# Altium project RcMPPT-BMS.PrjPcb
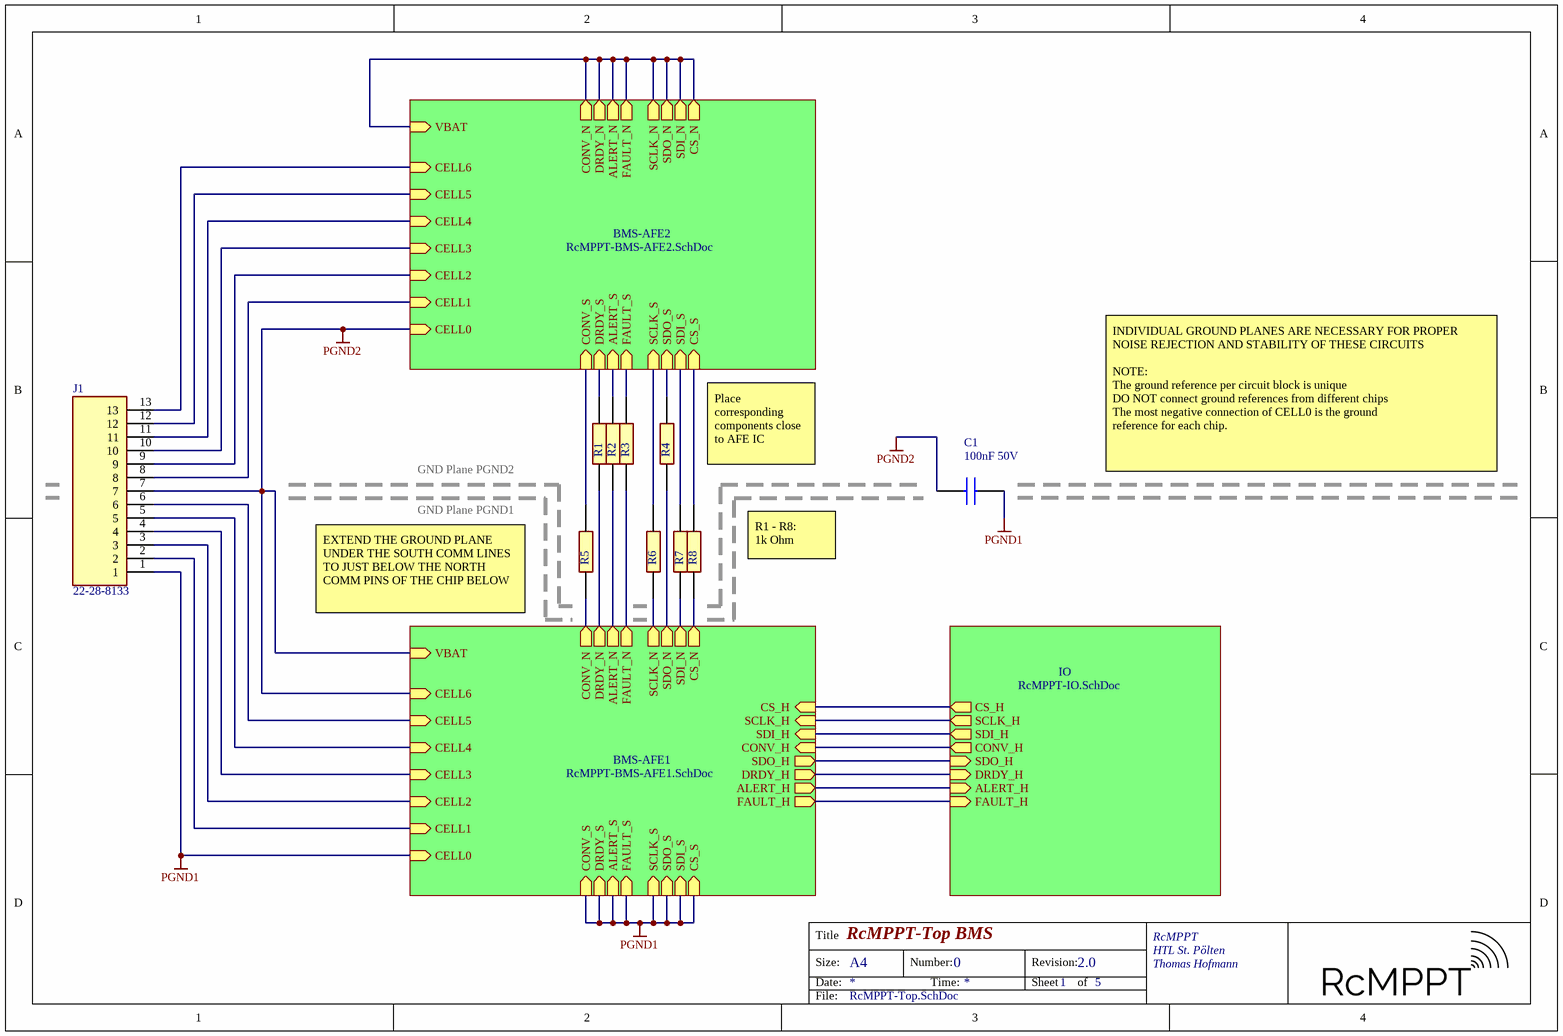
[diagram p0: RcMPPT-Top.SchDoc]
5 sheets, 194 parts. Net scope: hierarchical (ports join the sheet entries above them; power ports are global).
Board file: RcMPPT-BMS.PcbDoc
Sheets:
  RcMPPT-Top.SchDoc
    IO = RcMPPT-IO.SchDoc
    BMS-AFE1 = RcMPPT-BMS-AFE1.SchDoc
      U_RcMPPT-BMS-BFE-1-1 = RcMPPT-BMS-BFE.SchDoc
      U_RcMPPT-BMS-BFE-1-2 = RcMPPT-BMS-BFE.SchDoc
      U_RcMPPT-BMS-BFE-1-3 = RcMPPT-BMS-BFE.SchDoc
      U_RcMPPT-BMS-BFE-1-4 = RcMPPT-BMS-BFE.SchDoc
      U_RcMPPT-BMS-BFE-1-5 = RcMPPT-BMS-BFE.SchDoc
      U_RcMPPT-BMS-BFE-1-6 = RcMPPT-BMS-BFE.SchDoc
    BMS-AFE2 = RcMPPT-BMS-AFE2.SchDoc
      U_RcMPPT-BMS-BFE-2-1 = RcMPPT-BMS-BFE.SchDoc
      U_RcMPPT-BMS-BFE-2-2 = RcMPPT-BMS-BFE.SchDoc
      U_RcMPPT-BMS-BFE-2-3 = RcMPPT-BMS-BFE.SchDoc
      U_RcMPPT-BMS-BFE-2-4 = RcMPPT-BMS-BFE.SchDoc
      U_RcMPPT-BMS-BFE-2-5 = RcMPPT-BMS-BFE.SchDoc
      U_RcMPPT-BMS-BFE-2-6 = RcMPPT-BMS-BFE.SchDoc

## Sheet RcMPPT-Top.SchDoc: RcMPPT-Top BMS
size A4; Author: Thomas Hofmann; CompanyName: HTL St. Pölten; Address2: Frenchs Forest; Address3: NSW; Address4: Australia 2086; DocumentNumber: 0; Revision: 2.0; SheetNumber: 1; SheetTotal: 5

### Parts
C1  100nF 50V  [CAPC1608X97N]
J1  22-28-8133  [HDRRA13W66P0X254_1X13_3302X229X249P]
R1  1k  [RESC1005X40N]  (value not drawn)
R2  1k  [RESC1005X40N]  (value not drawn)
R3  1k  [RESC1005X40N]  (value not drawn)
R4  1k  [RESC1005X40N]  (value not drawn)
R5  1k  [RESC1005X40N]  (value not drawn)
R6  1k  [RESC1005X40N]  (value not drawn)
R7  1k  [RESC1005X40N]  (value not drawn)
R8  1k  [RESC1005X40N]  (value not drawn)

### Sub-sheets
BMS-AFE1 = RcMPPT-BMS-AFE1.SchDoc: CONV_N (out), DRDY_N (out), ALERT_N (out), FAULT_N (out), SCLK_N (out), SDO_N (out), SDI_N (out), CS_N (out), CONV_S (in), DRDY_S (in), ALERT_S (in), FAULT_S (in), SCLK_S (in), SDO_S (in), SDI_S (in), CS_S (in), VBAT (in), CELL0 (in), CELL1 (in), CELL2 (in), CELL3 (in), CELL4 (in), CELL5 (in), CELL6 (in), CS_H (in), SCLK_H (in), SDI_H (in), CONV_H (in), SDO_H (out), DRDY_H (out), ALERT_H (out), FAULT_H (out)
BMS-AFE2 = RcMPPT-BMS-AFE2.SchDoc: CONV_N (out), DRDY_N (out), ALERT_N (out), FAULT_N (out), SCLK_N (out), SDO_N (out), SDI_N (out), CS_N (out), CONV_S (in), DRDY_S (in), ALERT_S (in), FAULT_S (in), SCLK_S (in), SDO_S (in), SDI_S (in), CS_S (in), VBAT (in), CELL0 (in), CELL1 (in), CELL2 (in), CELL3 (in), CELL4 (in), CELL5 (in), CELL6 (in)
IO = RcMPPT-IO.SchDoc: CS_H (out), SCLK_H (out), SDI_H (out), CONV_H (out), SDO_H (in), DRDY_H (in), ALERT_H (in), FAULT_H (in)

### Nets
PGND1: C1.1 J1.1 ; sheet BMS-AFE1/CONV_S, sheet BMS-AFE1/DRDY_S, sheet BMS-AFE1/ALERT_S, sheet BMS-AFE1/FAULT_S, sheet BMS-AFE1/SCLK_S, sheet BMS-AFE1/SDO_S, sheet BMS-AFE1/SDI_S, sheet BMS-AFE1/CS_S, sheet BMS-AFE1/CELL0
PGND2: C1.2 J1.7 ; sheet BMS-AFE1/VBAT, sheet BMS-AFE1/CELL6, sheet BMS-AFE2/CELL0
NetC200_2: J1.13 ; sheet BMS-AFE2/CONV_N, sheet BMS-AFE2/DRDY_N, sheet BMS-AFE2/ALERT_N, sheet BMS-AFE2/FAULT_N, sheet BMS-AFE2/SCLK_N, sheet BMS-AFE2/SDO_N, sheet BMS-AFE2/SDI_N, sheet BMS-AFE2/CS_N, sheet BMS-AFE2/VBAT, sheet BMS-AFE2/CELL6
NetC300_U_RcMPPT-BMS-BFE-1-1_2: J1.2 ; sheet BMS-AFE1/CELL1
NetC300_U_RcMPPT-BMS-BFE-1-2_2: J1.3 ; sheet BMS-AFE1/CELL2
NetC300_U_RcMPPT-BMS-BFE-1-3_2: J1.4 ; sheet BMS-AFE1/CELL3
NetC300_U_RcMPPT-BMS-BFE-1-4_2: J1.5 ; sheet BMS-AFE1/CELL4
NetC300_U_RcMPPT-BMS-BFE-1-5_2: J1.6 ; sheet BMS-AFE1/CELL5
NetC300_U_RcMPPT-BMS-BFE-2-1_2: J1.8 ; sheet BMS-AFE2/CELL1
NetC300_U_RcMPPT-BMS-BFE-2-2_2: J1.9 ; sheet BMS-AFE2/CELL2
NetC300_U_RcMPPT-BMS-BFE-2-3_2: J1.10 ; sheet BMS-AFE2/CELL3
NetC300_U_RcMPPT-BMS-BFE-2-4_2: J1.11 ; sheet BMS-AFE2/CELL4
NetC300_U_RcMPPT-BMS-BFE-2-5_2: J1.12 ; sheet BMS-AFE2/CELL5
NetIC100_36: sheet IO/CONV_H, sheet BMS-AFE1/CONV_H
NetIC100_37: sheet IO/DRDY_H, sheet BMS-AFE1/DRDY_H
NetIC100_38: sheet IO/ALERT_H, sheet BMS-AFE1/ALERT_H
NetIC100_39: sheet IO/FAULT_H, sheet BMS-AFE1/FAULT_H
NetIC100_40: sheet IO/SCLK_H, sheet BMS-AFE1/SCLK_H
NetIC100_41: sheet IO/SDO_H, sheet BMS-AFE1/SDO_H
NetIC100_42: sheet IO/SDI_H, sheet BMS-AFE1/SDI_H
NetIC100_43: sheet IO/CS_H, sheet BMS-AFE1/CS_H
NetIC100_52: R8.1 ; sheet BMS-AFE1/CS_N
NetIC100_53: R7.1 ; sheet BMS-AFE1/SDI_N
NetIC100_54: R4.1 ; sheet BMS-AFE1/SDO_N
NetIC100_55: R6.1 ; sheet BMS-AFE1/SCLK_N
NetIC100_56: R3.1 ; sheet BMS-AFE1/FAULT_N
NetIC100_57: R2.1 ; sheet BMS-AFE1/ALERT_N
NetIC100_58: R1.1 ; sheet BMS-AFE1/DRDY_N
NetIC100_59: R5.1 ; sheet BMS-AFE1/CONV_N
NetIC200_21: R5.2 ; sheet BMS-AFE2/CONV_S
NetIC200_22: R1.2 ; sheet BMS-AFE2/DRDY_S
NetIC200_23: R2.2 ; sheet BMS-AFE2/ALERT_S
NetIC200_24: R3.2 ; sheet BMS-AFE2/FAULT_S
NetIC200_26: R6.2 ; sheet BMS-AFE2/SCLK_S
NetIC200_27: R4.2 ; sheet BMS-AFE2/SDO_S
NetIC200_28: R7.2 ; sheet BMS-AFE2/SDI_S
NetIC200_29: R8.2 ; sheet BMS-AFE2/CS_S

### Notes on the sheet
- GND Plane PGND2
- GND Plane PGND1
- (near R4) Place corresponding components close to AFE IC
- INDIVIDUAL GROUND PLANES ARE NECESSARY FOR PROPER
  NOISE REJECTION AND STABILITY OF THESE CIRCUITS
  NOTE:
  The ground reference per circuit block is unique
  DO NOT connect ground references from different chips
  The most negative connection of CELL0 is the ground
  reference for each chip.
- R1 - R8:
  1k Ohm
- EXTEND THE GROUND PLANE
  UNDER THE SOUTH COMM LINES
  TO JUST BELOW THE NORTH
  COMM PINS OF THE CHIP BELOW
- Title
- Size:
- Date:
- A4
- Number:
- Time:
- Revision:
- Sheet
- of
- RcMPPT
- File:

### Library data of the parts
C1 = C0603: Capacitor; Height: 0.97
J1 = 22-28-8133: Connector; Manufacturer_Name: Molex; Datasheet Link: https://www.molex.com/pdm_docs/sd/022288133_sd.pdf; Height: 2.49mm; Manufacturer_Part_Number: 22-28-8133; Mouser Part Number: 538-22-28-8133; Mouser Price/Stock: https://www.mouser.co.uk/ProductDetail/Molex/22-28-8133?qs=l%252BWx29wYPrwPQBTZUVDqKw%3D%3D
R1-R8 = R0402: Resistor; Height: 0.4mm

## Sheet RcMPPT-IO.SchDoc: RcMPPT-BMS-IO
size A4; Author: Thomas Hofmann; CompanyName: HTL St. Pölten; Organization: HTL St. Pölten; Address1: RcMPPT; Address2: Frenchs Forest; Address3: NSW; Address4: Australia 2086; DocumentNumber: 5; Revision: 2.0; SheetNumber: 5; SheetTotal: 5
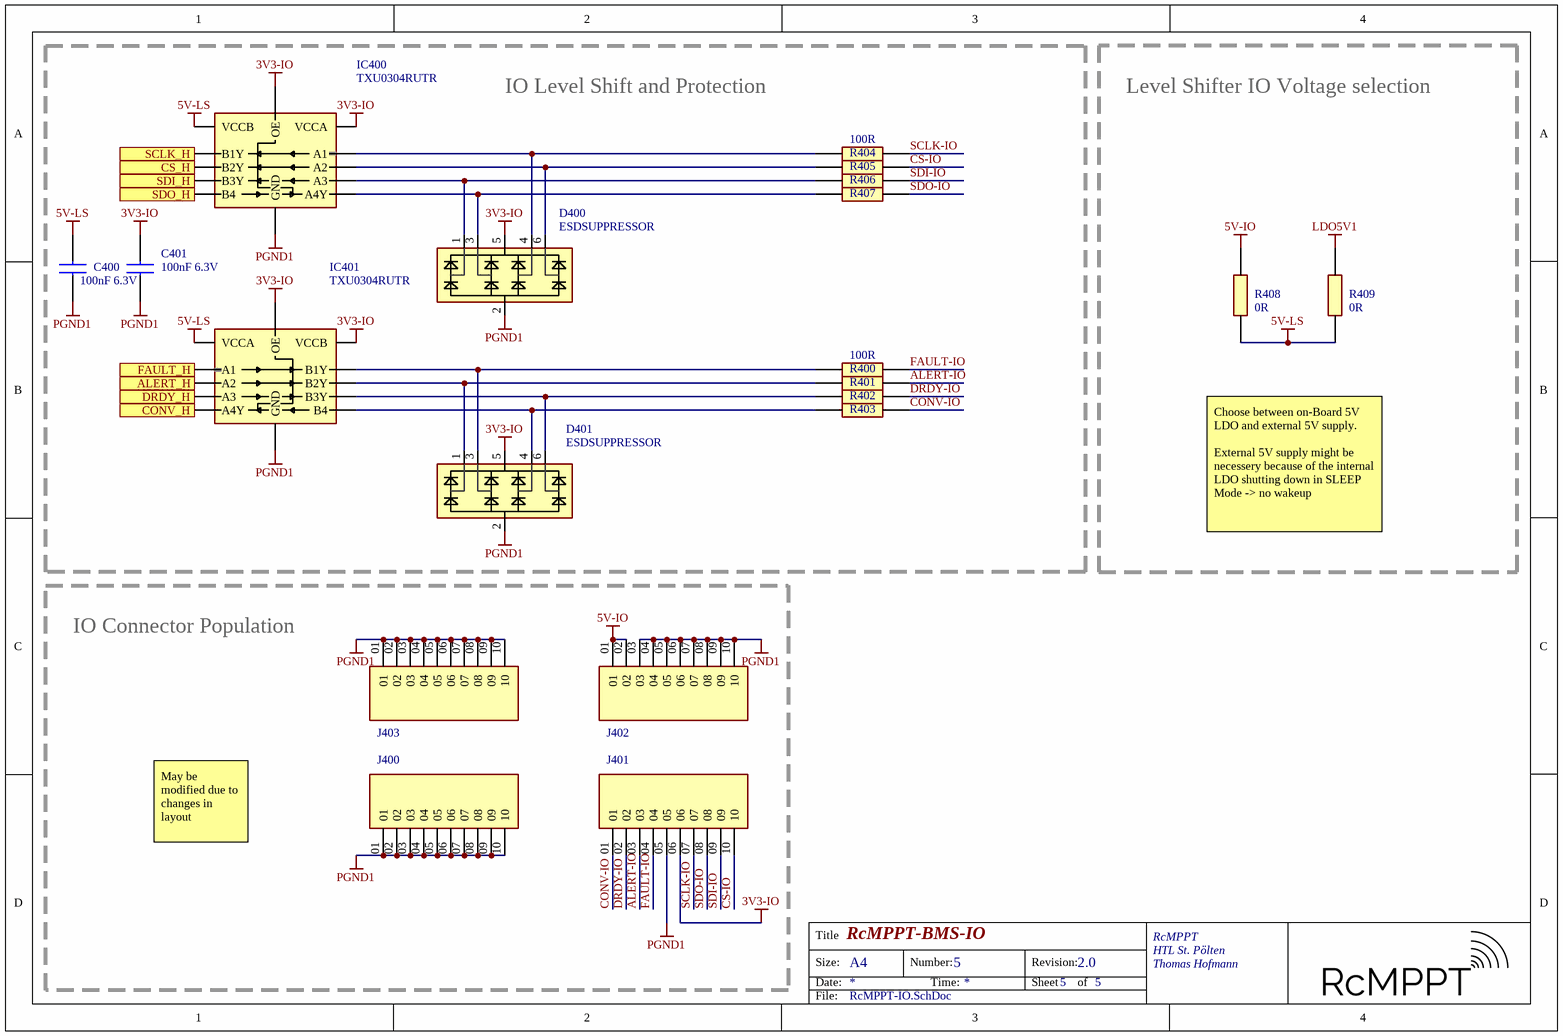
[diagram p1: RcMPPT-IO.SchDoc]

### Parts
C400  100nF 6.3V  [CAPC1608X97N]
C401  100nF 6.3V  [CAPC1608X97N]
D400  ESDSUPPRESSOR  [SOT23-6]
D401  ESDSUPPRESSOR  [SOT23-6]
IC400  TXU0304RUTR  [UQFN-12]
IC401  TXU0304RUTR  [UQFN-12]
J400  SMS-110-01-G-S  [SAMTEC_SMS-110-X-X-S]  (value not drawn)
J401  SMS-110-01-G-S  [SAMTEC_SMS-110-X-X-S]  (value not drawn)
J402  SMS-110-01-G-S  [SAMTEC_SMS-110-X-X-S]  (value not drawn)
J403  SMS-110-01-G-S  [SAMTEC_SMS-110-X-X-S]  (value not drawn)
R400  100R  [RESC1005X40N]
R401  100R  [RESC1005X40N]  (value not drawn)
R402  100R  [RESC1005X40N]  (value not drawn)
R403  100R  [RESC1005X40N]  (value not drawn)
R404  100R  [RESC1005X40N]
R405  100R  [RESC1005X40N]  (value not drawn)
R406  100R  [RESC1005X40N]  (value not drawn)
R407  100R  [RESC1005X40N]  (value not drawn)
R408  0R  [RESC1005X40N]
R409  0R  [RESC1005X40N]

### Blocks framed on the sheet
IO Level Shift and Protection: C400 C401 D400 D401 IC400 IC401 R400-R407
Level Shifter IO Voltage selection: R408 R409
IO Connector Population: J400-J403

### Ports
ALERT_H (in), CONV_H (out), CS_H (out), DRDY_H (in), FAULT_H (in), SCLK_H (out), SDI_H (out), SDO_H (in)

### Nets
3V3-IO: C401.2 D400.5(VDD) D401.5(VDD) IC400.1,_13(VCCA) IC400.12(OE) IC401.11(VCCB) IC401.12(OE) J401.06
5V-IO: J402.01 J402.02 R408.2
5V-LS: C400.2 IC400.11(VCCB) IC401.1,_13(VCCA) R408.1 R409.1
LDO5V1: R409.2
PGND1: C400.1 C401.1 D400.2(GND) D401.2(GND) IC400.6(GND) IC401.6(GND) J400.01 J400.02 J400.03 J400.04 J400.05 J400.06 J400.07 J400.08 J400.09 J400.10 J401.05 J402.03 J402.04 J402.05 J402.06 J402.07 J402.08 J402.09 J402.10 J403.01 J403.02 J403.03 J403.04 J403.05 J403.06 J403.07 J403.08 J403.09 J403.10
ALERT-IO: J401.03 R401.2  [project net ALERT-IO_5]
CONV-IO: J401.01 R403.2  [project net CONV-IO_5]
CS-IO: J401.10 R405.2  [project net CS-IO_5]
DRDY-IO: J401.02 R402.2  [project net DRDY-IO_5]
FAULT-IO: J401.04 R400.2  [project net FAULT-IO_5]
SCLK-IO: J401.07 R404.2  [project net SCLK-IO_5]
SDI-IO: J401.09 R406.2  [project net SDI-IO_5]
SDO-IO: J401.08 R407.2  [project net SDO-IO_5]
NetD400_1: D400.1(CH1) IC400.4(A3) R406.1
NetD400_3: D400.3(CH2) IC400.5(A4Y) R407.1
NetD400_4: D400.4(CH3) IC400.2(A1) R404.1
NetD400_6: D400.6(CH4) IC400.3(A2) R405.1
NetD401_1: D401.1(CH1) IC401.9(B2Y) R401.1
NetD401_3: D401.3(CH2) IC401.10(B1Y) R400.1
NetD401_4: D401.4(CH3) IC401.7(B4) R403.1
NetD401_6: D401.6(CH4) IC401.8(B3Y) R402.1
NetIC100_36: IC401.5(A4Y) ; port CONV_H
NetIC100_37: IC401.4(A3) ; port DRDY_H
NetIC100_38: IC401.3(A2) ; port ALERT_H
NetIC100_39: IC401.2(A1) ; port FAULT_H
NetIC100_40: IC400.10(B1Y) ; port SCLK_H
NetIC100_41: IC400.7(B4) ; port SDO_H
NetIC100_42: IC400.8(B3Y) ; port SDI_H
NetIC100_43: IC400.9(B2Y) ; port CS_H

### Notes on the sheet
- Choose between on-Board 5V LDO and external 5V supply.
  External 5V supply might be necessery because of the internal LDO shutting down in SLEEP Mode -> no wakeup
- May be modified due to changes in layout
- Title
- Size:
- Date:
- A4
- Number:
- Time:
- Revision:
- Sheet
- of
- RcMPPT
- File:

### Library data of the parts
C400 C401 = C0603: Capacitor; Height: 0.97
D400 D401 = ESDSUPPRESSOR: TVS Diode Array; Height: 0.6mm
IC400 IC401 = TXU0304RUTR: Integrated Circuit; Manufacturer_Name: Texas Instruments; Datasheet Link: https://www.ti.com/lit/ds/symlink/txu0304.pdf?ts=1639746896730&ref_url=https%253A%252F%252Fwww.ti.com%252Fproduct%252FTXU0304; Manufacturer_Part_Number: TXU0304RUTR; Mouser Part Number: 595-TXU0304RUTR; Mouser Price/Stock: https://www.mouser.at/ProductDetail/Texas-Instruments/TXU0304RUTR?qs=pBJMDPsKWf1XxvxZVB4EQA%3D%3D
J400-J403 = SMS-110-X-X-S: 10 Position Receptacle Connector 0.050" (1.27mm) Through Hole Gold; MF: {'manufacturer': u'Samtec'}; Package: None; Availability: Unavailable; Value: *; MP: SMS-110-X-X-S; Price: None
R400-R409 = R0402: Resistor; Height: 0.4mm

## Sheet RcMPPT-BMS-AFE1.SchDoc: RcMPPT-BMS-AFE-1
size A4; Author: Thomas Hofmann; CompanyName: HTL St. Pölten; Organization: Altium Limited; Address1: RcMPPT; Address2: Frenchs Forest; Address3: NSW; Address4: Australia 2086; DocumentNumber: 2; Revision: 2.0; SheetNumber: 2; SheetTotal: 5
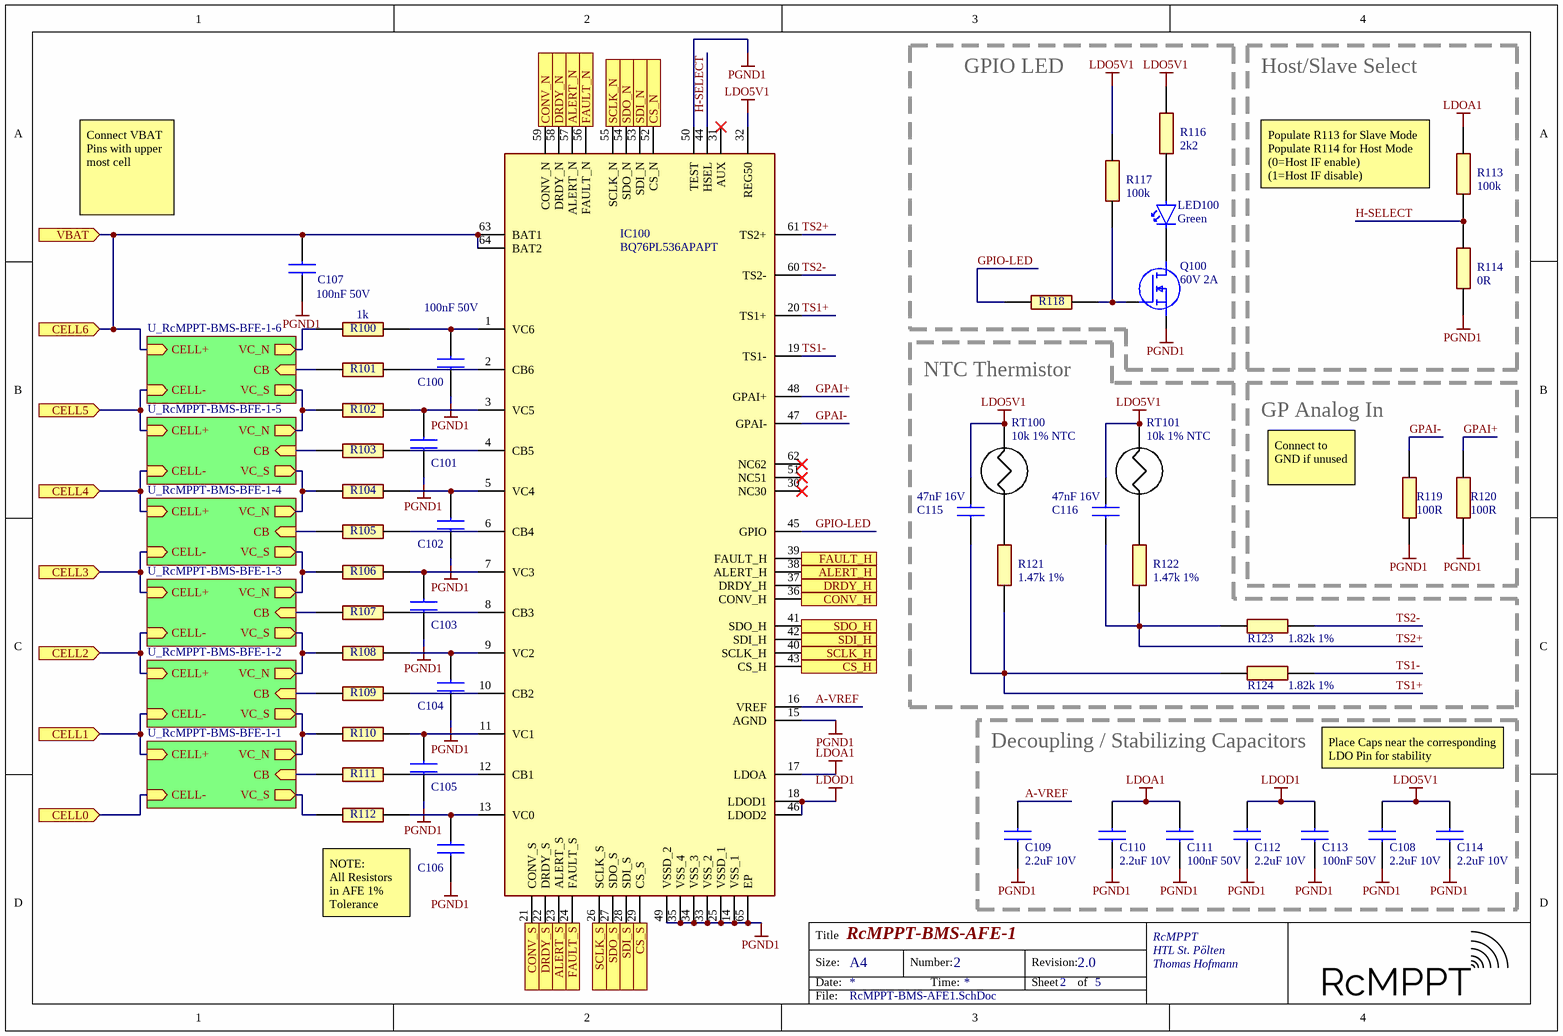
[diagram p2: RcMPPT-BMS-AFE1.SchDoc]

### Parts
C100  100nF 50V  [CAPC1608X97N]
C101  100nF 50V  [CAPC1608X97N]  (value not drawn)
C102  100nF 50V  [CAPC1608X97N]  (value not drawn)
C103  100nF 50V  [CAPC1608X97N]  (value not drawn)
C104  100nF 50V  [CAPC1608X97N]  (value not drawn)
C105  100nF 50V  [CAPC1608X97N]  (value not drawn)
C106  100nF 50V  [CAPC1608X97N]  (value not drawn)
C107  100nF 50V  [CAPC1608X97N]
C108  2.2uF 10V  [CAPC1608X97N]
C109  2.2uF 10V  [CAPC1608X97N]
C110  2.2uF 10V  [CAPC1608X97N]
C111  100nF 50V  [CAPC1608X97N]
C112  2.2uF 10V  [CAPC1608X97N]
C113  100nF 50V  [CAPC1608X97N]
C114  2.2uF 10V  [CAPC1608X97N]
C115  47nF 16V  [CAPC1608X97N]
C116  47nF 16V  [CAPC1608X97N]
IC100  BQ76PL536APAPT  [QFP50P1200X1200X120-65N]
LED100  Green  [CHIPLED_0603]
Q100  60V 2A  [SOT96P240X110-3N]
R100  1k  [RESC1005X40N]
R101  1k  [RESC1005X40N]  (value not drawn)
R102  1k  [RESC1005X40N]  (value not drawn)
R103  1k  [RESC1005X40N]  (value not drawn)
R104  1k  [RESC1005X40N]  (value not drawn)
R105  1k  [RESC1005X40N]  (value not drawn)
R106  1k  [RESC1005X40N]  (value not drawn)
R107  1k  [RESC1005X40N]  (value not drawn)
R108  1k  [RESC1005X40N]  (value not drawn)
R109  1k  [RESC1005X40N]  (value not drawn)
R110  1k  [RESC1005X40N]  (value not drawn)
R111  1k  [RESC1005X40N]  (value not drawn)
R112  1k  [RESC1005X40N]  (value not drawn)
R113  100k  [RESC1005X40N]
R114  0R  [RESC1005X40N]
R116  2k2  [RESC1005X40N]
R117  100k  [RESC1005X40N]
R118  100R  [RESC1005X40N]  (value not drawn)
R119  100R  [RESC1005X40N]
R120  100R  [RESC1005X40N]
R121  1.47k 1%  [RESC1608X50N]
R122  1.47k 1%  [RESC1608X50N]
R123  1.82k 1%  [RESC1608X50N]
R124  1.82k 1%  [RESC1608X50N]
RT100  10k 1% NTC  [THRMC1608X90N]
RT101  10k 1% NTC  [THRMC1608X90N]

### Blocks framed on the sheet
GPIO LED: LED100 Q100 R116-R118
Host/Slave Select: R113 R114
NTC Thermistor: C115 C116 R121-R124 RT100 RT101
GP Analog In: R119 R120
Decoupling / Stabilizing Capacitors: C108-C114

### Sub-sheets
U_RcMPPT-BMS-BFE-1-1 = RcMPPT-BMS-BFE.SchDoc: CB (in), VC_S (out), CELL+ (in), CELL- (in), VC_N (out)
U_RcMPPT-BMS-BFE-1-2 = RcMPPT-BMS-BFE.SchDoc: CB (in), VC_S (out), CELL+ (in), CELL- (in), VC_N (out)
U_RcMPPT-BMS-BFE-1-3 = RcMPPT-BMS-BFE.SchDoc: CB (in), VC_S (out), CELL+ (in), CELL- (in), VC_N (out)
U_RcMPPT-BMS-BFE-1-4 = RcMPPT-BMS-BFE.SchDoc: CB (in), VC_S (out), CELL+ (in), CELL- (in), VC_N (out)
U_RcMPPT-BMS-BFE-1-5 = RcMPPT-BMS-BFE.SchDoc: CB (in), VC_S (out), CELL+ (in), CELL- (in), VC_N (out)
U_RcMPPT-BMS-BFE-1-6 = RcMPPT-BMS-BFE.SchDoc: CB (in), VC_S (out), CELL+ (in), CELL- (in), VC_N (out)

### Ports
ALERT_H (out), ALERT_N (out), ALERT_S (in), CELL0 (in), CELL1 (in), CELL2 (in), CELL3 (in), CELL4 (in), CELL5 (in), CELL6 (in), CONV_H (in), CONV_N (out), CONV_S (in), CS_H (in), CS_N (out), CS_S (in), DRDY_H (out), DRDY_N (out), DRDY_S (in), FAULT_H (out), FAULT_N (out), FAULT_S (in), SCLK_H (in), SCLK_N (out), SCLK_S (in), SDI_H (in), SDI_N (out), SDI_S (in), SDO_H (out), SDO_N (out), SDO_S (in), VBAT (in)

### Nets
LDO5V1: C108.2 C114.2 C115.2 C116.2 IC100.32(REG50) R116.2 R117.2 RT100.2 RT101.2
LDOA1: C110.2 C111.2 IC100.17(LDOA) R113.2
LDOD1: C112.2 C113.2 IC100.18(LDOD1) IC100.46(LDOD2)
PGND1: C100.1 C101.1 C102.1 C103.1 C104.1 C105.1 C106.1 C107.1 C108.1 C109.1 C110.1 C111.1 C112.1 C113.1 C114.1 IC100.14(VSS_1) IC100.15(AGND) IC100.21(CONV_S) IC100.22(DRDY_S) IC100.23(ALERT_S) IC100.24(FAULT_S) IC100.25(VSSD_1) IC100.26(SCLK_S) IC100.27(SDO_S) IC100.28(SDI_S) IC100.29(CS_S) IC100.33(VSS_2) IC100.34(VSS_3) IC100.35(VSS_4) IC100.49(VSSD_2) IC100.50(TEST) IC100.65(EP) Q100.2(S) R112.1 R114.2 R119.2 R120.2 ; port CS_S, port SDI_S, port SDO_S, port SCLK_S, port FAULT_S, port ALERT_S, port DRDY_S, port CONV_S, port CELL0, sheet U_RcMPPT-BMS-BFE-1-1/VC_S, sheet U_RcMPPT-BMS-BFE-1-1/CELL-
PGND2: C107.2 IC100.63(BAT1) IC100.64(BAT2) R100.1 ; port CELL6, port VBAT, sheet U_RcMPPT-BMS-BFE-1-6/CELL+, sheet U_RcMPPT-BMS-BFE-1-6/VC_N
A-VREF: C109.2 IC100.16(VREF)  [project net A-VREF_2]
GPAI+: IC100.48(GPAI+) R120.1  [project net GPAI+_2]
GPAI-: IC100.47(GPAI-) R119.1  [project net GPAI-_2]
GPIO-LED: IC100.45(GPIO) R118.2  [project net GPIO-LED_2]
H-SELECT: IC100.44(HSEL) R113.1 R114.1  [project net H-SELECT_2]
TS1+: C115.1 IC100.20(TS1+) R121.1 R124.2  [project net TS1+_2]
TS1-: IC100.19(TS1-) R124.1  [project net TS1-_2]
TS2+: C116.1 IC100.61(TS2+) R122.1 R123.2  [project net TS2+_2]
TS2-: IC100.60(TS2-) R123.1  [project net TS2-_2]
NetC100_2: C100.2 IC100.1(VC6) R100.2
NetC101_2: C101.2 IC100.3(VC5) R102.2
NetC102_2: C102.2 IC100.5(VC4) R104.2
NetC103_2: C103.2 IC100.7(VC3) R106.2
NetC104_2: C104.2 IC100.9(VC2) R108.2
NetC105_2: C105.2 IC100.11(VC1) R110.2
NetC106_2: C106.2 IC100.13(VC0) R112.2
NetC300_U_RcMPPT-BMS-BFE-1-1_2: R110.1 ; port CELL1, sheet U_RcMPPT-BMS-BFE-1-1/CELL+, sheet U_RcMPPT-BMS-BFE-1-1/VC_N, sheet U_RcMPPT-BMS-BFE-1-2/VC_S, sheet U_RcMPPT-BMS-BFE-1-2/CELL-
NetC300_U_RcMPPT-BMS-BFE-1-2_2: R108.1 ; port CELL2, sheet U_RcMPPT-BMS-BFE-1-2/CELL+, sheet U_RcMPPT-BMS-BFE-1-2/VC_N, sheet U_RcMPPT-BMS-BFE-1-3/VC_S, sheet U_RcMPPT-BMS-BFE-1-3/CELL-
NetC300_U_RcMPPT-BMS-BFE-1-3_2: R106.1 ; port CELL3, sheet U_RcMPPT-BMS-BFE-1-3/CELL+, sheet U_RcMPPT-BMS-BFE-1-3/VC_N, sheet U_RcMPPT-BMS-BFE-1-4/VC_S, sheet U_RcMPPT-BMS-BFE-1-4/CELL-
NetC300_U_RcMPPT-BMS-BFE-1-4_2: R104.1 ; port CELL4, sheet U_RcMPPT-BMS-BFE-1-4/CELL+, sheet U_RcMPPT-BMS-BFE-1-4/VC_N, sheet U_RcMPPT-BMS-BFE-1-5/VC_S, sheet U_RcMPPT-BMS-BFE-1-5/CELL-
NetC300_U_RcMPPT-BMS-BFE-1-5_2: R102.1 ; port CELL5, sheet U_RcMPPT-BMS-BFE-1-5/CELL+, sheet U_RcMPPT-BMS-BFE-1-5/VC_N, sheet U_RcMPPT-BMS-BFE-1-6/VC_S, sheet U_RcMPPT-BMS-BFE-1-6/CELL-
NetD301_U_RcMPPT-BMS-BFE-1-1_1: R111.1 ; sheet U_RcMPPT-BMS-BFE-1-1/CB
NetD301_U_RcMPPT-BMS-BFE-1-2_1: R109.1 ; sheet U_RcMPPT-BMS-BFE-1-2/CB
NetD301_U_RcMPPT-BMS-BFE-1-3_1: R107.1 ; sheet U_RcMPPT-BMS-BFE-1-3/CB
NetD301_U_RcMPPT-BMS-BFE-1-4_1: R105.1 ; sheet U_RcMPPT-BMS-BFE-1-4/CB
NetD301_U_RcMPPT-BMS-BFE-1-5_1: R103.1 ; sheet U_RcMPPT-BMS-BFE-1-5/CB
NetD301_U_RcMPPT-BMS-BFE-1-6_1: R101.1 ; sheet U_RcMPPT-BMS-BFE-1-6/CB
NetIC100_2: IC100.2(CB6) R101.2
NetIC100_4: IC100.4(CB5) R103.2
NetIC100_6: IC100.6(CB4) R105.2
NetIC100_8: IC100.8(CB3) R107.2
NetIC100_10: IC100.10(CB2) R109.2
NetIC100_12: IC100.12(CB1) R111.2
NetIC100_36: IC100.36(CONV_H) ; port CONV_H
NetIC100_37: IC100.37(DRDY_H) ; port DRDY_H
NetIC100_38: IC100.38(ALERT_H) ; port ALERT_H
NetIC100_39: IC100.39(FAULT_H) ; port FAULT_H
NetIC100_40: IC100.40(SCLK_H) ; port SCLK_H
NetIC100_41: IC100.41(SDO_H) ; port SDO_H
NetIC100_42: IC100.42(SDI_H) ; port SDI_H
NetIC100_43: IC100.43(CS_H) ; port CS_H
NetIC100_52: IC100.52(CS_N) ; port CS_N
NetIC100_53: IC100.53(SDI_N) ; port SDI_N
NetIC100_54: IC100.54(SDO_N) ; port SDO_N
NetIC100_55: IC100.55(SCLK_N) ; port SCLK_N
NetIC100_56: IC100.56(FAULT_N) ; port FAULT_N
NetIC100_57: IC100.57(ALERT_N) ; port ALERT_N
NetIC100_58: IC100.58(DRDY_N) ; port DRDY_N
NetIC100_59: IC100.59(CONV_N) ; port CONV_N
NetLED100_1: LED100.1(K) Q100.3(D)
NetLED100_2: LED100.2(A) R116.1
NetQ100_1: Q100.1(G) R117.1 R118.1
NetR121_2: R121.2 RT100.1
NetR122_2: R122.2 RT101.1

Not connected (* = marked no-connect by the designer): IC100 30(NC30)* 31(AUX)* 51(NC51)* 62(NC62)*

### Notes on the sheet
- Connect VBAT Pins with upper most cell
- (near R113) Populate R113 for Slave Mode
  Populate R114 for Host Mode
  (0=Host IF enable)
  (1=Host IF disable)
- Connect to GND if unused
- Place Caps near the corresponding LDO Pin for stability
- NOTE:
  All Resistors
  in AFE 1% Tolerance
- Title
- Size:
- Date:
- A4
- Number:
- Time:
- Revision:
- Sheet
- of
- RcMPPT
- File:

### Library data of the parts
C100-C116 = C0603: Capacitor; Height: 0.97
IC100 = BQ76PL536APAPT: Integrated Circuit; Manufacturer_Name: Texas Instruments; Datasheet Link: http://www.ti.com/lit/gpn/bq76pl536a; Height: 1.2mm; Manufacturer_Part_Number: BQ76PL536APAPT; Mouser Part Number: 595-BQ76PL536APAPT; Mouser Price/Stock: https://www.mouser.co.uk/ProductDetail/Texas-Instruments/BQ76PL536APAPT?qs=UlfnwZ2x8nT1EXA%252BD%252BEfIQ%3D%3D; Arrow Part Number: BQ76PL536APAPT; Arrow Price/Stock: https://www.arrow.com/en/products/bq76pl536apapt/texas-instruments?region=nac
LED100 = CHIPLED0603: LED; Mouser Price/Stock: https://www.mouser.at/c/optoelectronics/led-lighting/led-emitters/standard-leds-smd/?series=CHIPLED%200603&instock=y
Q100 = NMOS: MOSFET (N-Channel)
R100-R114 R116-R120 = R0402: Resistor; Height: 0.4mm
R121-R124 = R0603: Resistor; Height: 0.55mm
RT100 RT101 = ERT-J1VG103FA: Thermistor; Manufacturer_Name: Panasonic; Datasheet Link: https://componentsearchengine.com/Datasheets/1/ERT-J1VG103FA.pdf; Height: 0.9mm; Manufacturer_Part_Number: ERT-J1VG103FA; Mouser Part Number: 667-ERT-J1VG103FA; Mouser Price/Stock: https://www.mouser.co.uk/ProductDetail/Panasonic/ERT-J1VG103FA?qs=Tap6ps20mlMpYFuAQ7bHkg%3D%3D; Arrow Part Number: ERT-J1VG103FA; Arrow Price/Stock: https://www.arrow.com/en/products/ert-j1vg103fa/panasonic

## Sheet RcMPPT-BMS-BFE.SchDoc: RcMPPT-BMS-BFE
size A4; Author: Thomas Hofmann; CompanyName: HTL St. Pölten; DocumentNumber: 4; Revision: 2.0; SheetNumber: 4; SheetTotal: 5
Used 12 times, as channels BMS-AFE1/U_RcMPPT-BMS-BFE-1-1, BMS-AFE1/U_RcMPPT-BMS-BFE-1-2, BMS-AFE1/U_RcMPPT-BMS-BFE-1-3, BMS-AFE1/U_RcMPPT-BMS-BFE-1-4, BMS-AFE1/U_RcMPPT-BMS-BFE-1-5, BMS-AFE1/U_RcMPPT-BMS-BFE-1-6, BMS-AFE2/U_RcMPPT-BMS-BFE-2-1, BMS-AFE2/U_RcMPPT-BMS-BFE-2-2, BMS-AFE2/U_RcMPPT-BMS-BFE-2-3, BMS-AFE2/U_RcMPPT-BMS-BFE-2-4, BMS-AFE2/U_RcMPPT-BMS-BFE-2-5, BMS-AFE2/U_RcMPPT-BMS-BFE-2-6. Parts and nets are listed once, with the designators drawn on the sheet.
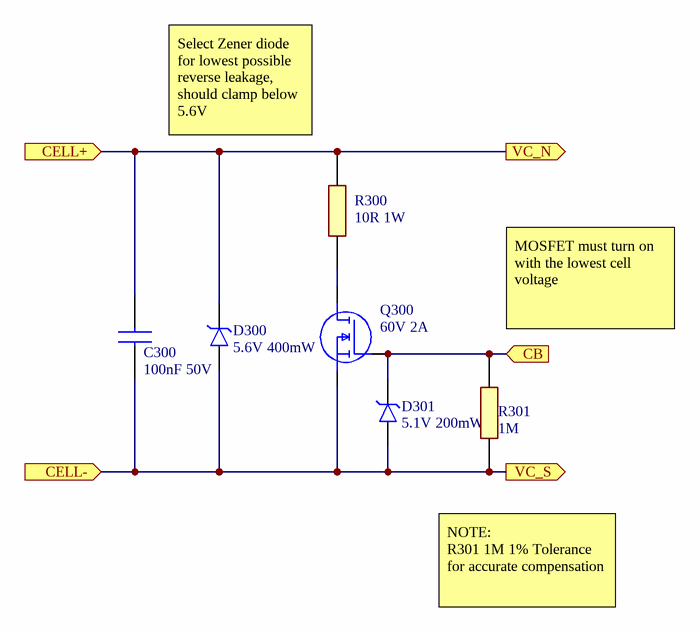
[diagram p3: RcMPPT-BMS-BFE.SchDoc]

### Parts
C300  100nF 50V  [CAPC1608X97N]
D300  5.6V 400mW  [SOD-123FL]
D301  5.1V 200mW  [SOD-323]
Q300  60V 2A  [SOT96P240X110-3N]
R300  10R 1W  [RESC6331X75N]
R301  1M  [RESC1005X40N]

### Ports
CB (in), CELL+ (in), CELL- (in), VC_N (out), VC_S (out)

### Nets
CB: D301.1(K) Q300.1(G) R301.2 ; port CB
CELL+: C300.2 D300.1(K) R300.2 ; port CELL+, port VC_N
CELL-: C300.1 D300.2(A) D301.2(A) Q300.2(S) R301.1 ; port VC_S, port CELL-
NetQ300_3: Q300.3(D) R300.1

### Channels
BMS-AFE1/U_RcMPPT-BMS-BFE-1-1: designators end in _U_RcMPPT-BMS-BFE-1-1; ports CB=NetD301_U_RcMPPT-BMS-BFE-1-1_1 CELL+=NetC300_U_RcMPPT-BMS-BFE-1-1_2 CELL-=PGND1 VC_N=NetC300_U_RcMPPT-BMS-BFE-1-1_2 VC_S=PGND1
BMS-AFE1/U_RcMPPT-BMS-BFE-1-2: designators end in _U_RcMPPT-BMS-BFE-1-2; ports CB=NetD301_U_RcMPPT-BMS-BFE-1-2_1 CELL+=NetC300_U_RcMPPT-BMS-BFE-1-2_2 CELL-=NetC300_U_RcMPPT-BMS-BFE-1-1_2 VC_N=NetC300_U_RcMPPT-BMS-BFE-1-2_2 VC_S=NetC300_U_RcMPPT-BMS-BFE-1-1_2
BMS-AFE1/U_RcMPPT-BMS-BFE-1-3: designators end in _U_RcMPPT-BMS-BFE-1-3; ports CB=NetD301_U_RcMPPT-BMS-BFE-1-3_1 CELL+=NetC300_U_RcMPPT-BMS-BFE-1-3_2 CELL-=NetC300_U_RcMPPT-BMS-BFE-1-2_2 VC_N=NetC300_U_RcMPPT-BMS-BFE-1-3_2 VC_S=NetC300_U_RcMPPT-BMS-BFE-1-2_2
BMS-AFE1/U_RcMPPT-BMS-BFE-1-4: designators end in _U_RcMPPT-BMS-BFE-1-4; ports CB=NetD301_U_RcMPPT-BMS-BFE-1-4_1 CELL+=NetC300_U_RcMPPT-BMS-BFE-1-4_2 CELL-=NetC300_U_RcMPPT-BMS-BFE-1-3_2 VC_N=NetC300_U_RcMPPT-BMS-BFE-1-4_2 VC_S=NetC300_U_RcMPPT-BMS-BFE-1-3_2
BMS-AFE1/U_RcMPPT-BMS-BFE-1-5: designators end in _U_RcMPPT-BMS-BFE-1-5; ports CB=NetD301_U_RcMPPT-BMS-BFE-1-5_1 CELL+=NetC300_U_RcMPPT-BMS-BFE-1-5_2 CELL-=NetC300_U_RcMPPT-BMS-BFE-1-4_2 VC_N=NetC300_U_RcMPPT-BMS-BFE-1-5_2 VC_S=NetC300_U_RcMPPT-BMS-BFE-1-4_2
BMS-AFE1/U_RcMPPT-BMS-BFE-1-6: designators end in _U_RcMPPT-BMS-BFE-1-6; ports CB=NetD301_U_RcMPPT-BMS-BFE-1-6_1 CELL+=PGND2 CELL-=NetC300_U_RcMPPT-BMS-BFE-1-5_2 VC_N=PGND2 VC_S=NetC300_U_RcMPPT-BMS-BFE-1-5_2
BMS-AFE2/U_RcMPPT-BMS-BFE-2-1: designators end in _U_RcMPPT-BMS-BFE-2-1; ports CB=NetD301_U_RcMPPT-BMS-BFE-2-1_1 CELL+=NetC300_U_RcMPPT-BMS-BFE-2-1_2 CELL-=PGND2 VC_N=NetC300_U_RcMPPT-BMS-BFE-2-1_2 VC_S=PGND2
BMS-AFE2/U_RcMPPT-BMS-BFE-2-2: designators end in _U_RcMPPT-BMS-BFE-2-2; ports CB=NetD301_U_RcMPPT-BMS-BFE-2-2_1 CELL+=NetC300_U_RcMPPT-BMS-BFE-2-2_2 CELL-=NetC300_U_RcMPPT-BMS-BFE-2-1_2 VC_N=NetC300_U_RcMPPT-BMS-BFE-2-2_2 VC_S=NetC300_U_RcMPPT-BMS-BFE-2-1_2
BMS-AFE2/U_RcMPPT-BMS-BFE-2-3: designators end in _U_RcMPPT-BMS-BFE-2-3; ports CB=NetD301_U_RcMPPT-BMS-BFE-2-3_1 CELL+=NetC300_U_RcMPPT-BMS-BFE-2-3_2 CELL-=NetC300_U_RcMPPT-BMS-BFE-2-2_2 VC_N=NetC300_U_RcMPPT-BMS-BFE-2-3_2 VC_S=NetC300_U_RcMPPT-BMS-BFE-2-2_2
BMS-AFE2/U_RcMPPT-BMS-BFE-2-4: designators end in _U_RcMPPT-BMS-BFE-2-4; ports CB=NetD301_U_RcMPPT-BMS-BFE-2-4_1 CELL+=NetC300_U_RcMPPT-BMS-BFE-2-4_2 CELL-=NetC300_U_RcMPPT-BMS-BFE-2-3_2 VC_N=NetC300_U_RcMPPT-BMS-BFE-2-4_2 VC_S=NetC300_U_RcMPPT-BMS-BFE-2-3_2
BMS-AFE2/U_RcMPPT-BMS-BFE-2-5: designators end in _U_RcMPPT-BMS-BFE-2-5; ports CB=NetD301_U_RcMPPT-BMS-BFE-2-5_1 CELL+=NetC300_U_RcMPPT-BMS-BFE-2-5_2 CELL-=NetC300_U_RcMPPT-BMS-BFE-2-4_2 VC_N=NetC300_U_RcMPPT-BMS-BFE-2-5_2 VC_S=NetC300_U_RcMPPT-BMS-BFE-2-4_2
BMS-AFE2/U_RcMPPT-BMS-BFE-2-6: designators end in _U_RcMPPT-BMS-BFE-2-6; ports CB=NetD301_U_RcMPPT-BMS-BFE-2-6_1 CELL+=NetC200_2 CELL-=NetC300_U_RcMPPT-BMS-BFE-2-5_2 VC_N=NetC200_2 VC_S=NetC300_U_RcMPPT-BMS-BFE-2-5_2

### Notes on the sheet
- (near R300) Select Zener diode for lowest possible reverse leakage, should clamp below 5.6V
- (near R301) MOSFET must turn on with the lowest cell voltage
- NOTE:
  R301 1M 1% Tolerance
  for accurate compensation
- Title
- Size:
- Date:
- A4
- Number:
- Time:
- Revision:
- Sheet
- of
- RcMPPT
- File:

### Library data of the parts
C300 = C0603: Capacitor; Height: 0.97
D300 D301 = ZENER-DIODE: ZENER Diode
Q300 = NMOS: MOSFET (N-Channel)
R300 = R2512: Resistor; Height: 0.75mm
R301 = R0402: Resistor; Height: 0.4mm

## Sheet RcMPPT-BMS-AFE2.SchDoc: RcMPPT-BMS-AFE2
size A4; Author: Thomas Hofmann; CompanyName: HTL St. Pölten; Organization: Altium Limited; Address1: RcMPPT; Address2: Frenchs Forest; Address3: NSW; Address4: Australia 2086; DocumentNumber: 3; Revision: 2.0; SheetNumber: 3; SheetTotal: 5
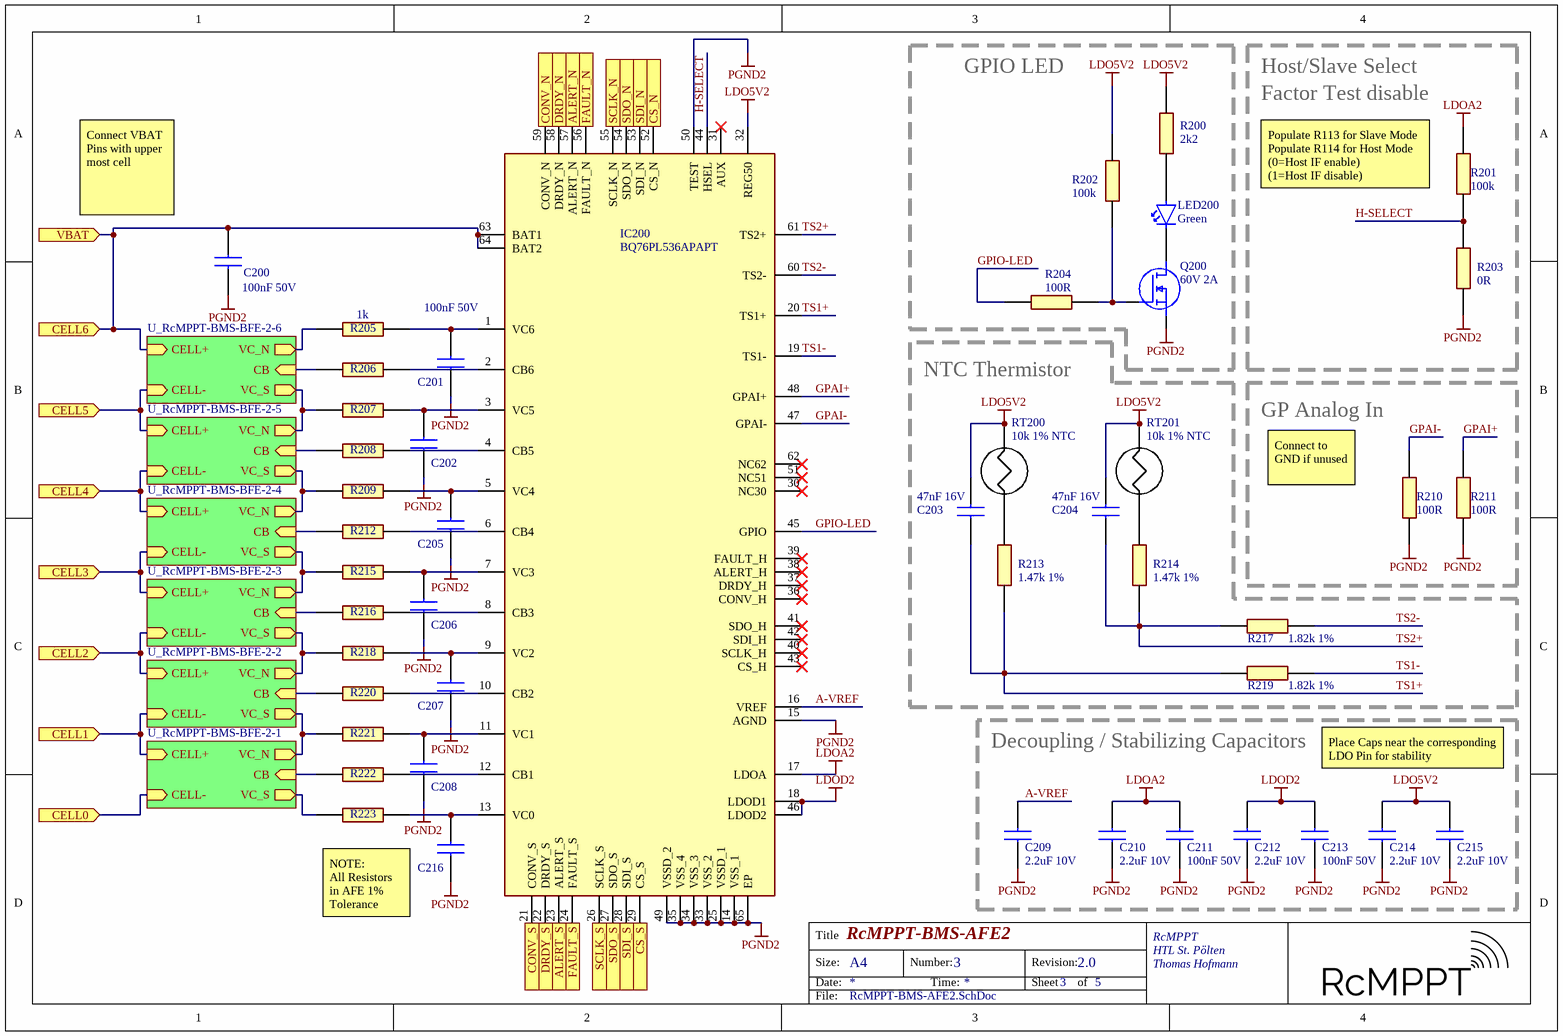
[diagram p4: RcMPPT-BMS-AFE2.SchDoc]

### Parts
C200  100nF 50V  [CAPC1608X97N]
C201  100nF 50V  [CAPC1608X97N]
C202  100nF 50V  [CAPC1608X97N]  (value not drawn)
C203  47nF 16V  [CAPC1608X97N]
C204  47nF 16V  [CAPC1608X97N]
C205  100nF 50V  [CAPC1608X97N]  (value not drawn)
C206  100nF 50V  [CAPC1608X97N]  (value not drawn)
C207  100nF 50V  [CAPC1608X97N]  (value not drawn)
C208  100nF 50V  [CAPC1608X97N]  (value not drawn)
C209  2.2uF 10V  [CAPC1608X97N]
C210  2.2uF 10V  [CAPC1608X97N]
C211  100nF 50V  [CAPC1608X97N]
C212  2.2uF 10V  [CAPC1608X97N]
C213  100nF 50V  [CAPC1608X97N]
C214  2.2uF 10V  [CAPC1608X97N]
C215  2.2uF 10V  [CAPC1608X97N]
C216  100nF 50V  [CAPC1608X97N]  (value not drawn)
IC200  BQ76PL536APAPT  [QFP50P1200X1200X120-65N]
LED200  Green  [CHIPLED_0603]
Q200  60V 2A  [SOT96P240X110-3N]
R200  2k2  [RESC1005X40N]
R201  100k  [RESC1005X40N]
R202  100k  [RESC1005X40N]
R203  0R  [RESC1005X40N]
R204  100R  [RESC1005X40N]
R205  1k  [RESC1005X40N]
R206  1k  [RESC1005X40N]  (value not drawn)
R207  1k  [RESC1005X40N]  (value not drawn)
R208  1k  [RESC1005X40N]  (value not drawn)
R209  1k  [RESC1005X40N]  (value not drawn)
R210  100R  [RESC1005X40N]
R211  100R  [RESC1005X40N]
R212  1k  [RESC1005X40N]  (value not drawn)
R213  1.47k 1%  [RESC1608X50N]
R214  1.47k 1%  [RESC1608X50N]
R215  1k  [RESC1005X40N]  (value not drawn)
R216  1k  [RESC1005X40N]  (value not drawn)
R217  1.82k 1%  [RESC1608X50N]
R218  1k  [RESC1005X40N]  (value not drawn)
R219  1.82k 1%  [RESC1608X50N]
R220  1k  [RESC1005X40N]  (value not drawn)
R221  1k  [RESC1005X40N]  (value not drawn)
R222  1k  [RESC1005X40N]  (value not drawn)
R223  1k  [RESC1005X40N]  (value not drawn)
RT200  10k 1% NTC  [THRMC1608X90N]
RT201  10k 1% NTC  [THRMC1608X90N]

### Blocks framed on the sheet
GPIO LED: LED200 Q200 R200 R202 R204
NTC Thermistor: C203 C204 R213 R214 R217 R219 RT200 RT201
GP Analog In: R210 R211
Decoupling / Stabilizing Capacitors: C209-C215

### Sub-sheets
U_RcMPPT-BMS-BFE-2-1 = RcMPPT-BMS-BFE.SchDoc: CB (in), VC_S (out), CELL+ (in), CELL- (in), VC_N (out)
U_RcMPPT-BMS-BFE-2-2 = RcMPPT-BMS-BFE.SchDoc: CB (in), VC_S (out), CELL+ (in), CELL- (in), VC_N (out)
U_RcMPPT-BMS-BFE-2-3 = RcMPPT-BMS-BFE.SchDoc: CB (in), VC_S (out), CELL+ (in), CELL- (in), VC_N (out)
U_RcMPPT-BMS-BFE-2-4 = RcMPPT-BMS-BFE.SchDoc: CB (in), VC_S (out), CELL+ (in), CELL- (in), VC_N (out)
U_RcMPPT-BMS-BFE-2-5 = RcMPPT-BMS-BFE.SchDoc: CB (in), VC_S (out), CELL+ (in), CELL- (in), VC_N (out)
U_RcMPPT-BMS-BFE-2-6 = RcMPPT-BMS-BFE.SchDoc: CB (in), VC_S (out), CELL+ (in), CELL- (in), VC_N (out)

### Ports
ALERT_N (out), ALERT_S (in), CELL0 (in), CELL1 (in), CELL2 (in), CELL3 (in), CELL4 (in), CELL5 (in), CELL6 (in), CONV_N (out), CONV_S (in), CS_N (out), CS_S (in), DRDY_N (out), DRDY_S (in), FAULT_N (out), FAULT_S (in), SCLK_N (out), SCLK_S (in), SDI_N (out), SDI_S (in), SDO_N (out), SDO_S (in), VBAT (in)

### Nets
LDO5V2: C203.2 C204.2 C214.2 C215.2 IC200.32(REG50) R200.2 R202.2 RT200.2 RT201.2
LDOA2: C210.2 C211.2 IC200.17(LDOA) R201.2
LDOD2: C212.2 C213.2 IC200.18(LDOD1) IC200.46(LDOD2)
PGND2: C200.1 C201.1 C202.1 C205.1 C206.1 C207.1 C208.1 C209.1 C210.1 C211.1 C212.1 C213.1 C214.1 C215.1 C216.1 IC200.14(VSS_1) IC200.15(AGND) IC200.25(VSSD_1) IC200.33(VSS_2) IC200.34(VSS_3) IC200.35(VSS_4) IC200.49(VSSD_2) IC200.50(TEST) IC200.65(EP) Q200.2(S) R203.2 R210.2 R211.2 R223.1 ; port CELL0, sheet U_RcMPPT-BMS-BFE-2-1/VC_S, sheet U_RcMPPT-BMS-BFE-2-1/CELL-
A-VREF: C209.2 IC200.16(VREF)  [project net A-VREF_3]
GPAI+: IC200.48(GPAI+) R211.1  [project net GPAI+_3]
GPAI-: IC200.47(GPAI-) R210.1  [project net GPAI-_3]
GPIO-LED: IC200.45(GPIO) R204.2  [project net GPIO-LED_3]
H-SELECT: IC200.44(HSEL) R201.1 R203.1  [project net H-SELECT_3]
TS1+: C203.1 IC200.20(TS1+) R213.1 R219.2  [project net TS1+_3]
TS1-: IC200.19(TS1-) R219.1  [project net TS1-_3]
TS2+: C204.1 IC200.61(TS2+) R214.1 R217.2  [project net TS2+_3]
TS2-: IC200.60(TS2-) R217.1  [project net TS2-_3]
NetC200_2: C200.2 IC200.52(CS_N) IC200.53(SDI_N) IC200.54(SDO_N) IC200.55(SCLK_N) IC200.56(FAULT_N) IC200.57(ALERT_N) IC200.58(DRDY_N) IC200.59(CONV_N) IC200.63(BAT1) IC200.64(BAT2) R205.1 ; port CS_N, port SDI_N, port SDO_N, port SCLK_N, port FAULT_N, port ALERT_N, port DRDY_N, port CONV_N, port CELL6, port VBAT, sheet U_RcMPPT-BMS-BFE-2-6/CELL+, sheet U_RcMPPT-BMS-BFE-2-6/VC_N
NetC201_2: C201.2 IC200.1(VC6) R205.2
NetC202_2: C202.2 IC200.3(VC5) R207.2
NetC205_2: C205.2 IC200.5(VC4) R209.2
NetC206_2: C206.2 IC200.7(VC3) R215.2
NetC207_2: C207.2 IC200.9(VC2) R218.2
NetC208_2: C208.2 IC200.11(VC1) R221.2
NetC216_2: C216.2 IC200.13(VC0) R223.2
NetC300_U_RcMPPT-BMS-BFE-2-1_2: R221.1 ; port CELL1, sheet U_RcMPPT-BMS-BFE-2-1/CELL+, sheet U_RcMPPT-BMS-BFE-2-1/VC_N, sheet U_RcMPPT-BMS-BFE-2-2/VC_S, sheet U_RcMPPT-BMS-BFE-2-2/CELL-
NetC300_U_RcMPPT-BMS-BFE-2-2_2: R218.1 ; port CELL2, sheet U_RcMPPT-BMS-BFE-2-2/CELL+, sheet U_RcMPPT-BMS-BFE-2-2/VC_N, sheet U_RcMPPT-BMS-BFE-2-3/VC_S, sheet U_RcMPPT-BMS-BFE-2-3/CELL-
NetC300_U_RcMPPT-BMS-BFE-2-3_2: R215.1 ; port CELL3, sheet U_RcMPPT-BMS-BFE-2-3/CELL+, sheet U_RcMPPT-BMS-BFE-2-3/VC_N, sheet U_RcMPPT-BMS-BFE-2-4/VC_S, sheet U_RcMPPT-BMS-BFE-2-4/CELL-
NetC300_U_RcMPPT-BMS-BFE-2-4_2: R209.1 ; port CELL4, sheet U_RcMPPT-BMS-BFE-2-4/CELL+, sheet U_RcMPPT-BMS-BFE-2-4/VC_N, sheet U_RcMPPT-BMS-BFE-2-5/VC_S, sheet U_RcMPPT-BMS-BFE-2-5/CELL-
NetC300_U_RcMPPT-BMS-BFE-2-5_2: R207.1 ; port CELL5, sheet U_RcMPPT-BMS-BFE-2-5/CELL+, sheet U_RcMPPT-BMS-BFE-2-5/VC_N, sheet U_RcMPPT-BMS-BFE-2-6/VC_S, sheet U_RcMPPT-BMS-BFE-2-6/CELL-
NetD301_U_RcMPPT-BMS-BFE-2-1_1: R222.1 ; sheet U_RcMPPT-BMS-BFE-2-1/CB
NetD301_U_RcMPPT-BMS-BFE-2-2_1: R220.1 ; sheet U_RcMPPT-BMS-BFE-2-2/CB
NetD301_U_RcMPPT-BMS-BFE-2-3_1: R216.1 ; sheet U_RcMPPT-BMS-BFE-2-3/CB
NetD301_U_RcMPPT-BMS-BFE-2-4_1: R212.1 ; sheet U_RcMPPT-BMS-BFE-2-4/CB
NetD301_U_RcMPPT-BMS-BFE-2-5_1: R208.1 ; sheet U_RcMPPT-BMS-BFE-2-5/CB
NetD301_U_RcMPPT-BMS-BFE-2-6_1: R206.1 ; sheet U_RcMPPT-BMS-BFE-2-6/CB
NetIC200_2: IC200.2(CB6) R206.2
NetIC200_4: IC200.4(CB5) R208.2
NetIC200_6: IC200.6(CB4) R212.2
NetIC200_8: IC200.8(CB3) R216.2
NetIC200_10: IC200.10(CB2) R220.2
NetIC200_12: IC200.12(CB1) R222.2
NetIC200_21: IC200.21(CONV_S) ; port CONV_S
NetIC200_22: IC200.22(DRDY_S) ; port DRDY_S
NetIC200_23: IC200.23(ALERT_S) ; port ALERT_S
NetIC200_24: IC200.24(FAULT_S) ; port FAULT_S
NetIC200_26: IC200.26(SCLK_S) ; port SCLK_S
NetIC200_27: IC200.27(SDO_S) ; port SDO_S
NetIC200_28: IC200.28(SDI_S) ; port SDI_S
NetIC200_29: IC200.29(CS_S) ; port CS_S
NetLED200_1: LED200.1(K) Q200.3(D)
NetLED200_2: LED200.2(A) R200.1
NetQ200_1: Q200.1(G) R202.1 R204.1
NetR213_2: R213.2 RT200.1
NetR214_2: R214.2 RT201.1

Not connected (* = marked no-connect by the designer): IC200 30(NC30)* 31(AUX)* 36(CONV_H)* 37(DRDY_H)* 38(ALERT_H)* 39(FAULT_H)* 40(SCLK_H)* 41(SDO_H)* 42(SDI_H)* 43(CS_H)* 51(NC51)* 62(NC62)*

### Notes on the sheet
- Host/Slave Select
- (near R201) Factor Test disable
- Connect VBAT Pins with upper most cell
- (near R201) Populate R113 for Slave Mode
  Populate R114 for Host Mode
  (0=Host IF enable)
  (1=Host IF disable)
- Connect to GND if unused
- Place Caps near the corresponding LDO Pin for stability
- NOTE:
  All Resistors
  in AFE 1% Tolerance
- Title
- Size:
- Date:
- A4
- Number:
- Time:
- Revision:
- Sheet
- of
- RcMPPT
- File:

### Library data of the parts
C200-C216 = C0603: Capacitor; Height: 0.97
IC200 = BQ76PL536APAPT: as IC100 on sheet RcMPPT-BMS-AFE1; Datasheet Link: http://www.ti.com/lit/gpn/bq76pl536a; Height: 1.2mm; Manufacturer_Part_Number: BQ76PL536APAPT; Mouser Part Number: 595-BQ76PL536APAPT; Mouser Price/Stock: https://www.mouser.co.uk/ProductDetail/Texas-Instruments/BQ76PL536APAPT?qs=UlfnwZ2x8nT1EXA%252BD%252BEfIQ%3D%3D; Arrow Part Number: BQ76PL536APAPT; Arrow Price/Stock: https://www.arrow.com/en/products/bq76pl536apapt/texas-instruments?region=nac
LED200 = CHIPLED0603: LED; Mouser Price/Stock: https://www.mouser.at/c/optoelectronics/led-lighting/led-emitters/standard-leds-smd/?series=CHIPLED%200603&instock=y
Q200 = NMOS: MOSFET (N-Channel)
R200-R212 R215 R216 R218 R220-R223 = R0402: Resistor; Height: 0.4mm
R213 R214 R217 R219 = R0603: Resistor; Height: 0.55mm
RT200 RT201 = ERT-J1VG103FA: Thermistor; Manufacturer_Name: Panasonic; Datasheet Link: https://componentsearchengine.com/Datasheets/1/ERT-J1VG103FA.pdf; Height: 0.9mm; Manufacturer_Part_Number: ERT-J1VG103FA; Mouser Part Number: 667-ERT-J1VG103FA; Mouser Price/Stock: https://www.mouser.co.uk/ProductDetail/Panasonic/ERT-J1VG103FA?qs=Tap6ps20mlMpYFuAQ7bHkg%3D%3D; Arrow Part Number: ERT-J1VG103FA; Arrow Price/Stock: https://www.arrow.com/en/products/ert-j1vg103fa/panasonic

## Nets that join several sheets
LDO5V1: RcMPPT-IO (R409.2), RcMPPT-BMS-AFE1 (9 pins)
PGND1: RcMPPT-Top (C1.1 J1.1), RcMPPT-IO (35 pins), RcMPPT-BMS-AFE1 (37 pins), BMS-AFE1/U_RcMPPT-BMS-BFE-1-1 (5 pins)
PGND2: RcMPPT-Top (C1.2 J1.7), RcMPPT-BMS-AFE1 (C107.2 IC100.63 IC100.64 R100.1), BMS-AFE1/U_RcMPPT-BMS-BFE-1-6 (C300_U_RcMPPT-BMS-BFE-1-6.2 D300_U_RcMPPT-BMS-BFE-1-6.1 R300_U_RcMPPT-BMS-BFE-1-6.2), RcMPPT-BMS-AFE2 (29 pins), BMS-AFE2/U_RcMPPT-BMS-BFE-2-1 (5 pins)
NetC200_2: RcMPPT-Top (J1.13), RcMPPT-BMS-AFE2 (12 pins), BMS-AFE2/U_RcMPPT-BMS-BFE-2-6 (C300_U_RcMPPT-BMS-BFE-2-6.2 D300_U_RcMPPT-BMS-BFE-2-6.1 R300_U_RcMPPT-BMS-BFE-2-6.2)
NetC300_U_RcMPPT-BMS-BFE-1-1_2: RcMPPT-Top (J1.2), RcMPPT-BMS-AFE1 (R110.1), BMS-AFE1/U_RcMPPT-BMS-BFE-1-1 (C300_U_RcMPPT-BMS-BFE-1-1.2 D300_U_RcMPPT-BMS-BFE-1-1.1 R300_U_RcMPPT-BMS-BFE-1-1.2), BMS-AFE1/U_RcMPPT-BMS-BFE-1-2 (5 pins)
NetC300_U_RcMPPT-BMS-BFE-1-2_2: RcMPPT-Top (J1.3), RcMPPT-BMS-AFE1 (R108.1), BMS-AFE1/U_RcMPPT-BMS-BFE-1-2 (C300_U_RcMPPT-BMS-BFE-1-2.2 D300_U_RcMPPT-BMS-BFE-1-2.1 R300_U_RcMPPT-BMS-BFE-1-2.2), BMS-AFE1/U_RcMPPT-BMS-BFE-1-3 (5 pins)
NetC300_U_RcMPPT-BMS-BFE-1-3_2: RcMPPT-Top (J1.4), RcMPPT-BMS-AFE1 (R106.1), BMS-AFE1/U_RcMPPT-BMS-BFE-1-3 (C300_U_RcMPPT-BMS-BFE-1-3.2 D300_U_RcMPPT-BMS-BFE-1-3.1 R300_U_RcMPPT-BMS-BFE-1-3.2), BMS-AFE1/U_RcMPPT-BMS-BFE-1-4 (5 pins)
NetC300_U_RcMPPT-BMS-BFE-1-4_2: RcMPPT-Top (J1.5), RcMPPT-BMS-AFE1 (R104.1), BMS-AFE1/U_RcMPPT-BMS-BFE-1-4 (C300_U_RcMPPT-BMS-BFE-1-4.2 D300_U_RcMPPT-BMS-BFE-1-4.1 R300_U_RcMPPT-BMS-BFE-1-4.2), BMS-AFE1/U_RcMPPT-BMS-BFE-1-5 (5 pins)
NetC300_U_RcMPPT-BMS-BFE-1-5_2: RcMPPT-Top (J1.6), RcMPPT-BMS-AFE1 (R102.1), BMS-AFE1/U_RcMPPT-BMS-BFE-1-5 (C300_U_RcMPPT-BMS-BFE-1-5.2 D300_U_RcMPPT-BMS-BFE-1-5.1 R300_U_RcMPPT-BMS-BFE-1-5.2), BMS-AFE1/U_RcMPPT-BMS-BFE-1-6 (5 pins)
NetC300_U_RcMPPT-BMS-BFE-2-1_2: RcMPPT-Top (J1.8), RcMPPT-BMS-AFE2 (R221.1), BMS-AFE2/U_RcMPPT-BMS-BFE-2-1 (C300_U_RcMPPT-BMS-BFE-2-1.2 D300_U_RcMPPT-BMS-BFE-2-1.1 R300_U_RcMPPT-BMS-BFE-2-1.2), BMS-AFE2/U_RcMPPT-BMS-BFE-2-2 (5 pins)
NetC300_U_RcMPPT-BMS-BFE-2-2_2: RcMPPT-Top (J1.9), RcMPPT-BMS-AFE2 (R218.1), BMS-AFE2/U_RcMPPT-BMS-BFE-2-2 (C300_U_RcMPPT-BMS-BFE-2-2.2 D300_U_RcMPPT-BMS-BFE-2-2.1 R300_U_RcMPPT-BMS-BFE-2-2.2), BMS-AFE2/U_RcMPPT-BMS-BFE-2-3 (5 pins)
NetC300_U_RcMPPT-BMS-BFE-2-3_2: RcMPPT-Top (J1.10), RcMPPT-BMS-AFE2 (R215.1), BMS-AFE2/U_RcMPPT-BMS-BFE-2-3 (C300_U_RcMPPT-BMS-BFE-2-3.2 D300_U_RcMPPT-BMS-BFE-2-3.1 R300_U_RcMPPT-BMS-BFE-2-3.2), BMS-AFE2/U_RcMPPT-BMS-BFE-2-4 (5 pins)
NetC300_U_RcMPPT-BMS-BFE-2-4_2: RcMPPT-Top (J1.11), RcMPPT-BMS-AFE2 (R209.1), BMS-AFE2/U_RcMPPT-BMS-BFE-2-4 (C300_U_RcMPPT-BMS-BFE-2-4.2 D300_U_RcMPPT-BMS-BFE-2-4.1 R300_U_RcMPPT-BMS-BFE-2-4.2), BMS-AFE2/U_RcMPPT-BMS-BFE-2-5 (5 pins)
NetC300_U_RcMPPT-BMS-BFE-2-5_2: RcMPPT-Top (J1.12), RcMPPT-BMS-AFE2 (R207.1), BMS-AFE2/U_RcMPPT-BMS-BFE-2-5 (C300_U_RcMPPT-BMS-BFE-2-5.2 D300_U_RcMPPT-BMS-BFE-2-5.1 R300_U_RcMPPT-BMS-BFE-2-5.2), BMS-AFE2/U_RcMPPT-BMS-BFE-2-6 (5 pins)
NetD301_U_RcMPPT-BMS-BFE-1-1_1: RcMPPT-BMS-AFE1 (R111.1), BMS-AFE1/U_RcMPPT-BMS-BFE-1-1 (D301_U_RcMPPT-BMS-BFE-1-1.1 Q300_U_RcMPPT-BMS-BFE-1-1.1 R301_U_RcMPPT-BMS-BFE-1-1.2)
NetD301_U_RcMPPT-BMS-BFE-1-2_1: RcMPPT-BMS-AFE1 (R109.1), BMS-AFE1/U_RcMPPT-BMS-BFE-1-2 (D301_U_RcMPPT-BMS-BFE-1-2.1 Q300_U_RcMPPT-BMS-BFE-1-2.1 R301_U_RcMPPT-BMS-BFE-1-2.2)
NetD301_U_RcMPPT-BMS-BFE-1-3_1: RcMPPT-BMS-AFE1 (R107.1), BMS-AFE1/U_RcMPPT-BMS-BFE-1-3 (D301_U_RcMPPT-BMS-BFE-1-3.1 Q300_U_RcMPPT-BMS-BFE-1-3.1 R301_U_RcMPPT-BMS-BFE-1-3.2)
NetD301_U_RcMPPT-BMS-BFE-1-4_1: RcMPPT-BMS-AFE1 (R105.1), BMS-AFE1/U_RcMPPT-BMS-BFE-1-4 (D301_U_RcMPPT-BMS-BFE-1-4.1 Q300_U_RcMPPT-BMS-BFE-1-4.1 R301_U_RcMPPT-BMS-BFE-1-4.2)
NetD301_U_RcMPPT-BMS-BFE-1-5_1: RcMPPT-BMS-AFE1 (R103.1), BMS-AFE1/U_RcMPPT-BMS-BFE-1-5 (D301_U_RcMPPT-BMS-BFE-1-5.1 Q300_U_RcMPPT-BMS-BFE-1-5.1 R301_U_RcMPPT-BMS-BFE-1-5.2)
NetD301_U_RcMPPT-BMS-BFE-1-6_1: RcMPPT-BMS-AFE1 (R101.1), BMS-AFE1/U_RcMPPT-BMS-BFE-1-6 (D301_U_RcMPPT-BMS-BFE-1-6.1 Q300_U_RcMPPT-BMS-BFE-1-6.1 R301_U_RcMPPT-BMS-BFE-1-6.2)
NetD301_U_RcMPPT-BMS-BFE-2-1_1: RcMPPT-BMS-AFE2 (R222.1), BMS-AFE2/U_RcMPPT-BMS-BFE-2-1 (D301_U_RcMPPT-BMS-BFE-2-1.1 Q300_U_RcMPPT-BMS-BFE-2-1.1 R301_U_RcMPPT-BMS-BFE-2-1.2)
NetD301_U_RcMPPT-BMS-BFE-2-2_1: RcMPPT-BMS-AFE2 (R220.1), BMS-AFE2/U_RcMPPT-BMS-BFE-2-2 (D301_U_RcMPPT-BMS-BFE-2-2.1 Q300_U_RcMPPT-BMS-BFE-2-2.1 R301_U_RcMPPT-BMS-BFE-2-2.2)
NetD301_U_RcMPPT-BMS-BFE-2-3_1: RcMPPT-BMS-AFE2 (R216.1), BMS-AFE2/U_RcMPPT-BMS-BFE-2-3 (D301_U_RcMPPT-BMS-BFE-2-3.1 Q300_U_RcMPPT-BMS-BFE-2-3.1 R301_U_RcMPPT-BMS-BFE-2-3.2)
NetD301_U_RcMPPT-BMS-BFE-2-4_1: RcMPPT-BMS-AFE2 (R212.1), BMS-AFE2/U_RcMPPT-BMS-BFE-2-4 (D301_U_RcMPPT-BMS-BFE-2-4.1 Q300_U_RcMPPT-BMS-BFE-2-4.1 R301_U_RcMPPT-BMS-BFE-2-4.2)
NetD301_U_RcMPPT-BMS-BFE-2-5_1: RcMPPT-BMS-AFE2 (R208.1), BMS-AFE2/U_RcMPPT-BMS-BFE-2-5 (D301_U_RcMPPT-BMS-BFE-2-5.1 Q300_U_RcMPPT-BMS-BFE-2-5.1 R301_U_RcMPPT-BMS-BFE-2-5.2)
NetD301_U_RcMPPT-BMS-BFE-2-6_1: RcMPPT-BMS-AFE2 (R206.1), BMS-AFE2/U_RcMPPT-BMS-BFE-2-6 (D301_U_RcMPPT-BMS-BFE-2-6.1 Q300_U_RcMPPT-BMS-BFE-2-6.1 R301_U_RcMPPT-BMS-BFE-2-6.2)
NetIC100_36: RcMPPT-IO (IC401.5), RcMPPT-BMS-AFE1 (IC100.36)
NetIC100_37: RcMPPT-IO (IC401.4), RcMPPT-BMS-AFE1 (IC100.37)
NetIC100_38: RcMPPT-IO (IC401.3), RcMPPT-BMS-AFE1 (IC100.38)
NetIC100_39: RcMPPT-IO (IC401.2), RcMPPT-BMS-AFE1 (IC100.39)
NetIC100_40: RcMPPT-IO (IC400.10), RcMPPT-BMS-AFE1 (IC100.40)
NetIC100_41: RcMPPT-IO (IC400.7), RcMPPT-BMS-AFE1 (IC100.41)
NetIC100_42: RcMPPT-IO (IC400.8), RcMPPT-BMS-AFE1 (IC100.42)
NetIC100_43: RcMPPT-IO (IC400.9), RcMPPT-BMS-AFE1 (IC100.43)
NetIC100_52: RcMPPT-Top (R8.1), RcMPPT-BMS-AFE1 (IC100.52)
NetIC100_53: RcMPPT-Top (R7.1), RcMPPT-BMS-AFE1 (IC100.53)
NetIC100_54: RcMPPT-Top (R4.1), RcMPPT-BMS-AFE1 (IC100.54)
NetIC100_55: RcMPPT-Top (R6.1), RcMPPT-BMS-AFE1 (IC100.55)
NetIC100_56: RcMPPT-Top (R3.1), RcMPPT-BMS-AFE1 (IC100.56)
NetIC100_57: RcMPPT-Top (R2.1), RcMPPT-BMS-AFE1 (IC100.57)
NetIC100_58: RcMPPT-Top (R1.1), RcMPPT-BMS-AFE1 (IC100.58)
NetIC100_59: RcMPPT-Top (R5.1), RcMPPT-BMS-AFE1 (IC100.59)
NetIC200_21: RcMPPT-Top (R5.2), RcMPPT-BMS-AFE2 (IC200.21)
NetIC200_22: RcMPPT-Top (R1.2), RcMPPT-BMS-AFE2 (IC200.22)
NetIC200_23: RcMPPT-Top (R2.2), RcMPPT-BMS-AFE2 (IC200.23)
NetIC200_24: RcMPPT-Top (R3.2), RcMPPT-BMS-AFE2 (IC200.24)
NetIC200_26: RcMPPT-Top (R6.2), RcMPPT-BMS-AFE2 (IC200.26)
NetIC200_27: RcMPPT-Top (R4.2), RcMPPT-BMS-AFE2 (IC200.27)
NetIC200_28: RcMPPT-Top (R7.2), RcMPPT-BMS-AFE2 (IC200.28)
NetIC200_29: RcMPPT-Top (R8.2), RcMPPT-BMS-AFE2 (IC200.29)